# EAGLE schematic SensorModule (EAGLE 7.2.0)
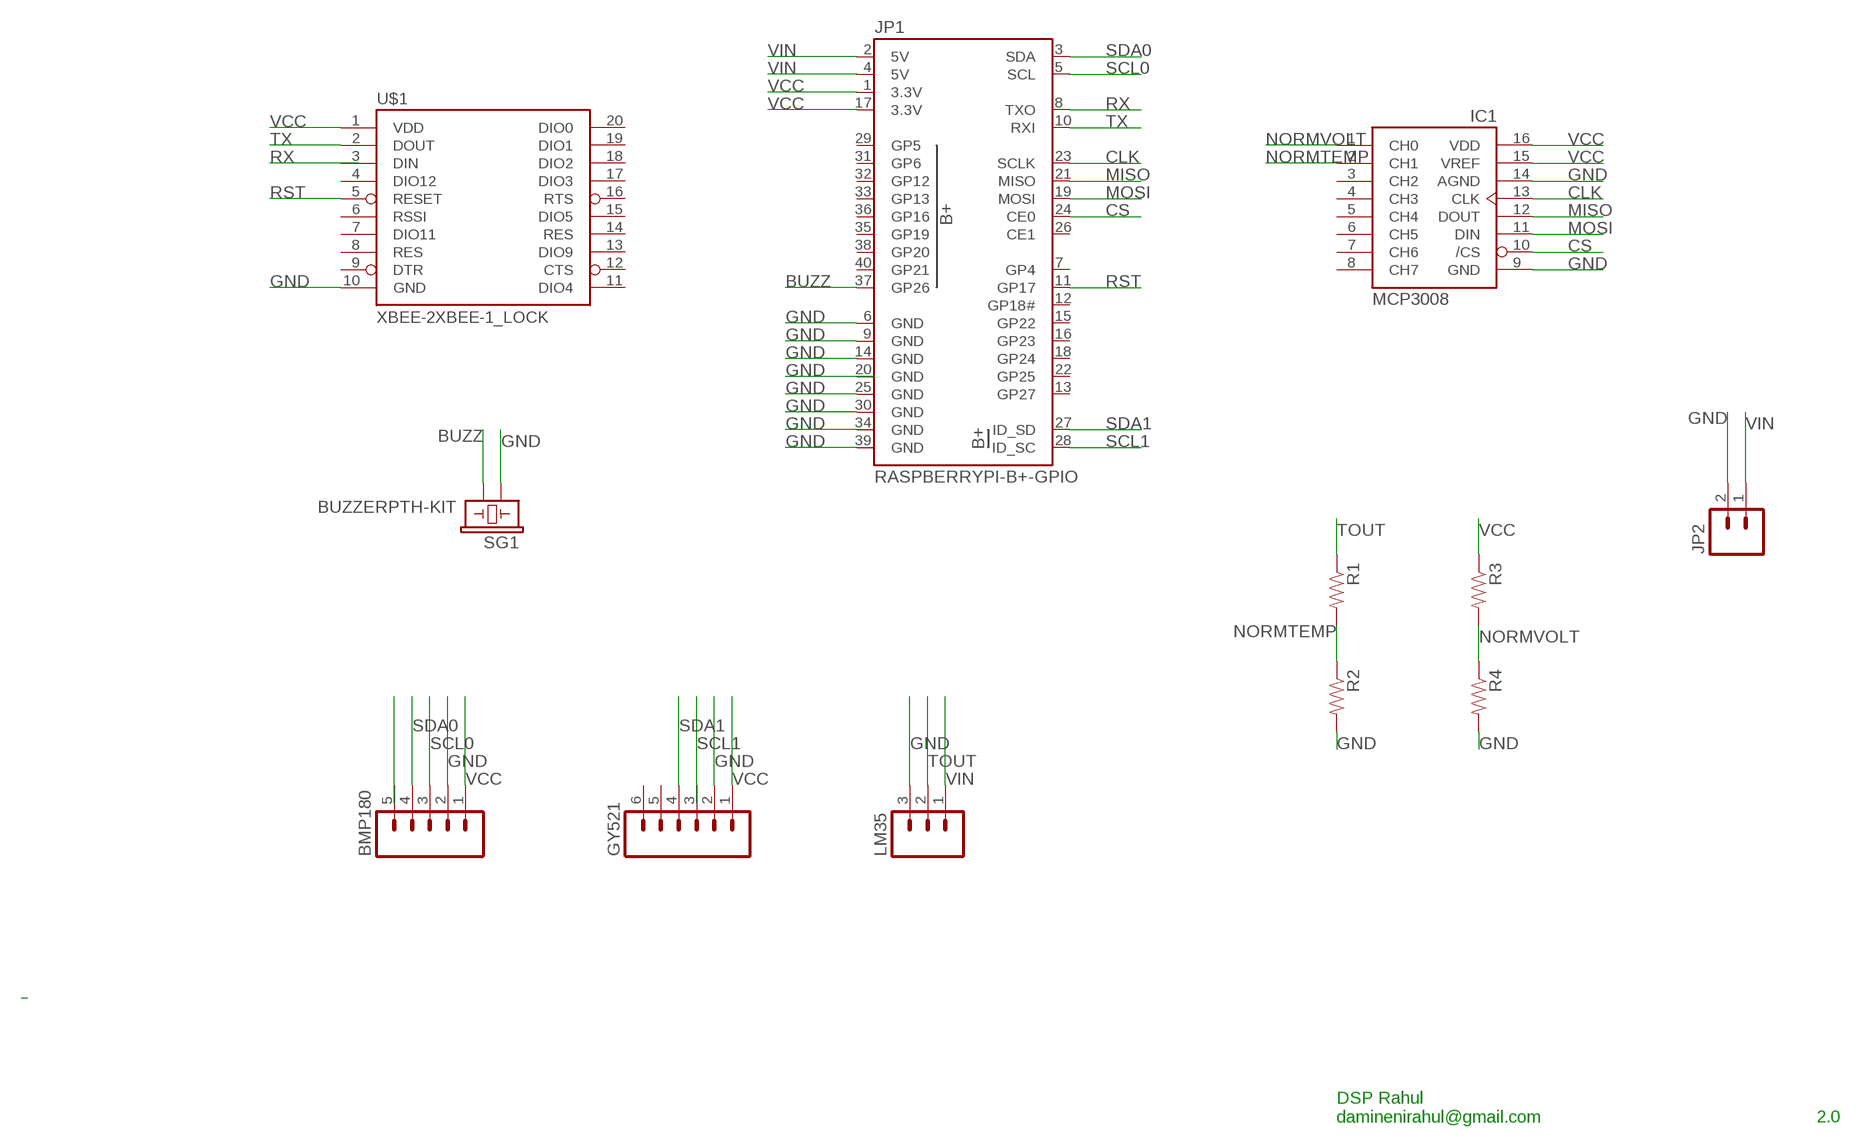
[diagram p0: schematic, sheet 1]

## Parts
BMP180  M05LOCK  [1X05_LOCK]
GY521  M06LOCK  [1X06_LOCK]
IC1  MCP3008  [DIL16]
JP1  RASPBERRYPI-B+-GPIO  [2X20-SHROUDED]
JP2  M023.5MM_LOCK  [SCREWTERMINAL-3.5MM-2_LOCK]
LM35  M03LOCK_LONGPADS  [1X03_LOCK_LONGPADS]
R1  RESISTORPTH-1/2W  [AXIAL-0.5]
R2  RESISTORPTH-1/2W  [AXIAL-0.5]
R3  RESISTORPTH-1/2W  [AXIAL-0.5]
R4  RESISTORPTH-1/2W  [AXIAL-0.5]
SG1  BUZZERPTH-KIT  [BUZZER-12MM-KIT]
U$1  XBEE-2XBEE-1_LOCK  [XBEE-1_LOCK]

## Nets
BUZZ: JP1.37(GP26) SG1.-
CLK: IC1.13(CLK) JP1.23(SCLK)
CS: IC1.10(/CS) JP1.24(CE0)
GND: BMP180.2 GY521.2 IC1.9(GND) IC1.14(AGND) JP1.6(GND) JP1.9(GND) JP1.14(GND) JP1.25(GND) JP1.30(GND) JP1.34(GND) JP1.39(GND) JP2.2 LM35.3 R2.P$2 R4.P$2 SG1.+ U$1.10(GND)
MISO: IC1.12(DOUT) JP1.21(MISO)
MOSI: IC1.11(DIN) JP1.19(MOSI)
NORMTEMP: IC1.2(CH1) R1.P$2 R2.P$1
NORMVOLT: IC1.1(CH0) R3.P$2 R4.P$1
RST: JP1.11(GP17) U$1.5(RESET)
RX: JP1.8(TXO)
SCL0: BMP180.3 JP1.5(SCL)
SCL1: JP1.28(ID_SC)
SDA0: BMP180.4 JP1.3(SDA)
SDA1: GY521.4 JP1.27(ID_SD)
TOUT: LM35.2 R1.P$1
TX: JP1.10(RXI) U$1.2(DOUT)
VCC: BMP180.1 GY521.1 IC1.15(VREF) IC1.16(VDD) JP1.1(3.3V) JP1.17(3.3V) R3.P$1 U$1.1(VDD)
VIN: JP1.2(5V) JP1.4(5V) JP2.1 LM35.1
Unconnected: BMP180.5 GY521.3 GY521.5 GY521.6 IC1.3(CH2) IC1.4(CH3) IC1.5(CH4) IC1.6(CH5) IC1.7(CH6) IC1.8(CH7) JP1.7(GP4) JP1.12(GP18#) JP1.13(GP27) JP1.15(GP22) JP1.16(GP23) JP1.18(GP24) JP1.22(GP25) JP1.26(CE1) JP1.29(GP5) JP1.31(GP6) JP1.32(GP12) JP1.33(GP13) JP1.35(GP19) JP1.36(GP16) JP1.38(GP20) JP1.40(GP21) U$1.3(DIN) U$1.4(DIO12) U$1.6(RSSI) U$1.7(DIO11) U$1.8(RES) U$1.9(DTR) U$1.11(DIO4) U$1.12(CTS) U$1.13(DIO9) U$1.14(RES) U$1.15(DIO5) U$1.16(RTS) U$1.17(DIO3) U$1.18(DIO2) U$1.19(DIO1) U$1.20(DIO0)

## Notes on the sheet
- DSP Rahul
  daminenirahul@gmail.com
- 2.0

## Power pins joined to a net without a drawn wire
GND: JP1.20(GND)

## Library data of the parts
BMP180 = SparkFun-Connectors:M05: Header 5 Standard 5-pin 0.1" header. Use with straight break away headers (SKU : PRT-00116), right angle break away headers (PRT-00553), swiss pins (PRT-00743), machine pins (PRT-00117), and female headers (PRT-00115). Molex polarized connector foot print use with SKU : PRT-08230 with associated crimp pins and housings.
GY521 = SparkFun-Connectors:M06: Header 6 Standard 6-pin 0.1" header. Use with straight break away headers (SKU : PRT-00116), right angle break away headers (PRT-00553), swiss pins (PRT-00743), machine pins (PRT-00117), and female headers (PRT-00115). Molex polarized connector foot print use with SKU : PRT-08094 with associated crimp pins and housings. NOTES ON THE VARIANTS LOCK and LOCK_LONGPADS... This footprint was designed to help hold the alignment of a through-hole component (i.e. 6-pin header) while soldering it into place. You may notice that each hole has been shifted either up or down by 0.005 of an inch from it's more standard position (which is a perfectly straight line). This slight alteration caused the pins (the squares in the middle) to touch the edges of the holes. Because they are alternating, it causes a "brace" to hold the component in place. 0.005 has proven to be the perfect amount of "off-center" position when using our standard breakaway headers. Although looks a little odd when you look at the bare footprint, once you have a header in there, the alteration is very hard to notice. Also,if you push a header all the way into place, it is covered up entirely on the bottom side. This idea of altering the position of holes to aid alignment will be further integrated into the Sparkfun Library for other footprints. It can help hold any component with 3 or more connection pins.
IC1 = adafruit:MCP3008
JP1 = SparkFun-Boards:RASPBERRYPI-B+-GPIO: Raspberry Pi B+ GPIO Header 2x20 pin connector
JP2 = SparkFun-Connectors:M02: Standard 2-pin 0.1" header. Use with - straight break away headers ( PRT-00116) - right angle break away headers (PRT-00553) - swiss pins (PRT-00743) - machine pins (PRT-00117) - female headers (PRT-00115) Molex polarized connector foot print use with: PRT-08233 with associated crimp pins and housings. 2.54_SCREWTERM for use with PRT-10571. 3.5mm Screw Terminal footprints for PRT-08084 5mm Screw Terminal footprints for use with PRT-08432; PROD_ID: CONN-08399
LM35 = SparkFun-Connectors:M03: Header 3 Standard 3-pin 0.1" header. Use with straight break away headers (SKU : PRT-00116), right angle break away headers (PRT-00553), swiss pins (PRT-00743), machine pins (PRT-00117), and female headers (PRT-00115). Molex polarized connector foot print use with SKU : PRT-08232 with associated crimp pins and housings.
R1-R4 = SparkFun-Passives:RESISTOR: Resistor Basic schematic elements and footprints for 0603, 1206, and PTH resistors.
SG1 = SparkFun-Electromechanical:BUZZER: Buzzer 12mm Spark Fun Electronics SKU : Comp-Buzzer; PROD_ID: COMP-08253
U$1 = SparkFun-RF:XBEE-2: Xbee module footprints SMT header is CONN-09042.